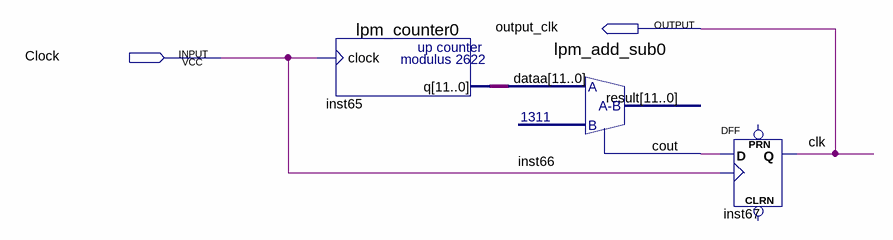
[diagram p0: schematic sheet]
// Quartus schematic ClockBlock.bdf as structural Verilog: 3 symbols, 2 pins
module ClockBlock (
  input  Clock,
  output output_clk
);

  wire inst66_cout;
  wire [11:0] inst65_q;

  lpm_counter0 inst65 (.clock(Clock), .q(inst65_q));
  lpm_add_sub0 inst66 (.dataa(inst65_q), .cout(inst66_cout));  // open: result
  DFF inst67 (.CLK(Clock), .D(inst66_cout), .Q(output_clk));  // open: CLRN, PRN

  // Other names for the same wires on the sheet: clk = output_clk
endmodule
